# Altium schematic sheet МПСУ-46342.21-004 Э3 Лист4.SchDoc
size 209 x 297 mm; Address1: Address1; Address2: Address2; Address3: Address3; Address4: Address4; SheetNumber: 1; Scale: 1:1; Разраб.: Иванов; Обозначение документа: АБВГ.123456.001 Э3; Пров.: Петров; Утв.: Сидоров; Наименование организации: ОАО "Ваша фирма"; Перв. применение: АБВГ.123456.000; Наименование изделия 1: Плата; Наименование изделия 2: Схема электрическая; Наименование изделия 3: принципиальная; Нач. отд.: Нач. отд.; Фамилия нач. отд.: Сидоров
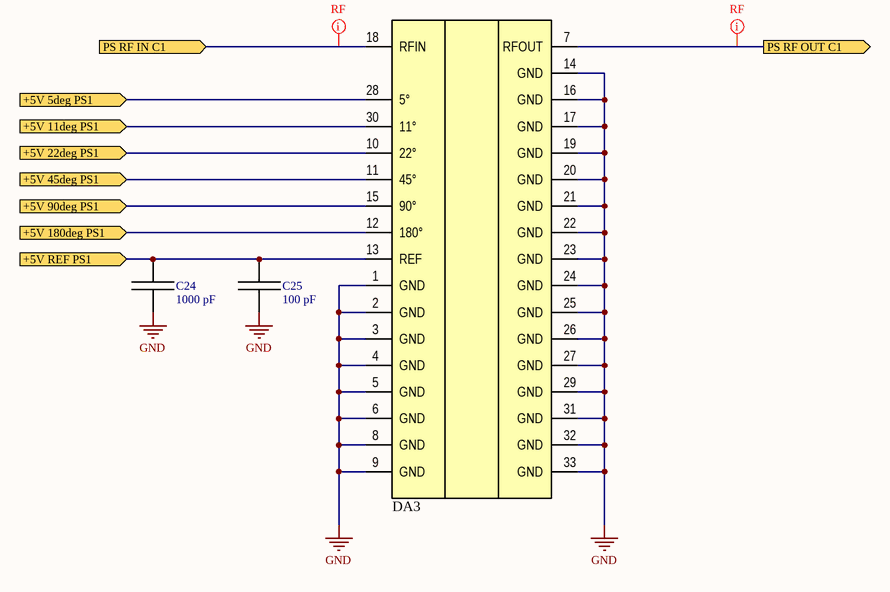
[diagram p0: МПСУ-46342.21-004 Э3 Лист4.SchDoc]

## Parts
C24  1000 pF  [CAPC100X50X55L20N]
C25  100 pF  [CAPC100X50X55L20N]
DA3  TGP2105-SM  [QFN33P50_500X500X80L46X25T340N]  (value not drawn)

## Ports
+5V 5deg PS1 (in), +5V 11deg PS1 (in), +5V 22deg PS1 (in), +5V 45deg PS1 (in), +5V 90deg PS1 (in), +5V 180deg PS1 (in), +5V REF PS1 (in), PS RF IN C1 (in), PS RF OUT C1 (out)

## Nets
GND: C24.1 C25.1 DA3.1(GND) DA3.2(GND) DA3.3(GND) DA3.4(GND) DA3.5(GND) DA3.6(GND) DA3.8(GND) DA3.9(GND) DA3.14(GND) DA3.16(GND) DA3.17(GND) DA3.19(GND) DA3.20(GND) DA3.21(GND) DA3.22(GND) DA3.23(GND) DA3.24(GND) DA3.25(GND) DA3.26(GND) DA3.27(GND) DA3.29(GND) DA3.31(GND) DA3.32(GND) DA3.33(GND)
+5V 5deg PS1: DA3.28(5°) ; port +5V 5deg PS1
+5V 11deg PS1: DA3.30(11°) ; port +5V 11deg PS1
+5V 22deg PS1: DA3.10(22°) ; port +5V 22deg PS1
+5V 45deg PS1: DA3.11(45°) ; port +5V 45deg PS1
+5V 90deg PS1: DA3.15(90°) ; port +5V 90deg PS1
+5V 180deg PS1: DA3.12(180°) ; port +5V 180deg PS1
+5V REF PS1: C24.2 C25.2 DA3.13(REF) ; port +5V REF PS1
PS RF IN C1: DA3.18(RFIN) ; port PS RF IN C1
PS RF OUT C1: DA3.7(RFOUT) ; port PS RF OUT C1

## Layout directives
net class RF: PS RF IN C1, PS RF OUT C1

## Notes on the sheet
- Перв. примен.
- Справ. №
- Подп. и дата
- Инв. № дубл.
- Взам. инв. №
- Разраб.
- Изм.
- Лист
- № докум.
- Подп.
- Дата
- Лит.
- Масса
- Масштаб
- Пров.
- Т.контр.
- Листов
- Инв. № подл.
- Утв.
- Н.контр.
- Копировал
- Формат А4

## Library data of the parts
C24 C25 = Capacitor: Capacitor, generic; Tolerance: 5 %; VDC: 20 V; PartNumber: *; Dielectric: *; Manufacturer: *; Package: 0402
  C24: Value: 1000 pF
  C25: Value: 100 pF
DA3 = TGP2105-SM 1: 6 - 18 GHz 6-Bit Digital Phase Shifter (+Vc); Manufacturer: Qorvo; PartNumber: TGP2105-SM; ComponentLink1Description: Component Page; ComponentLink1URL: https://www.qorvo.com/products/p/TGP2105-SM